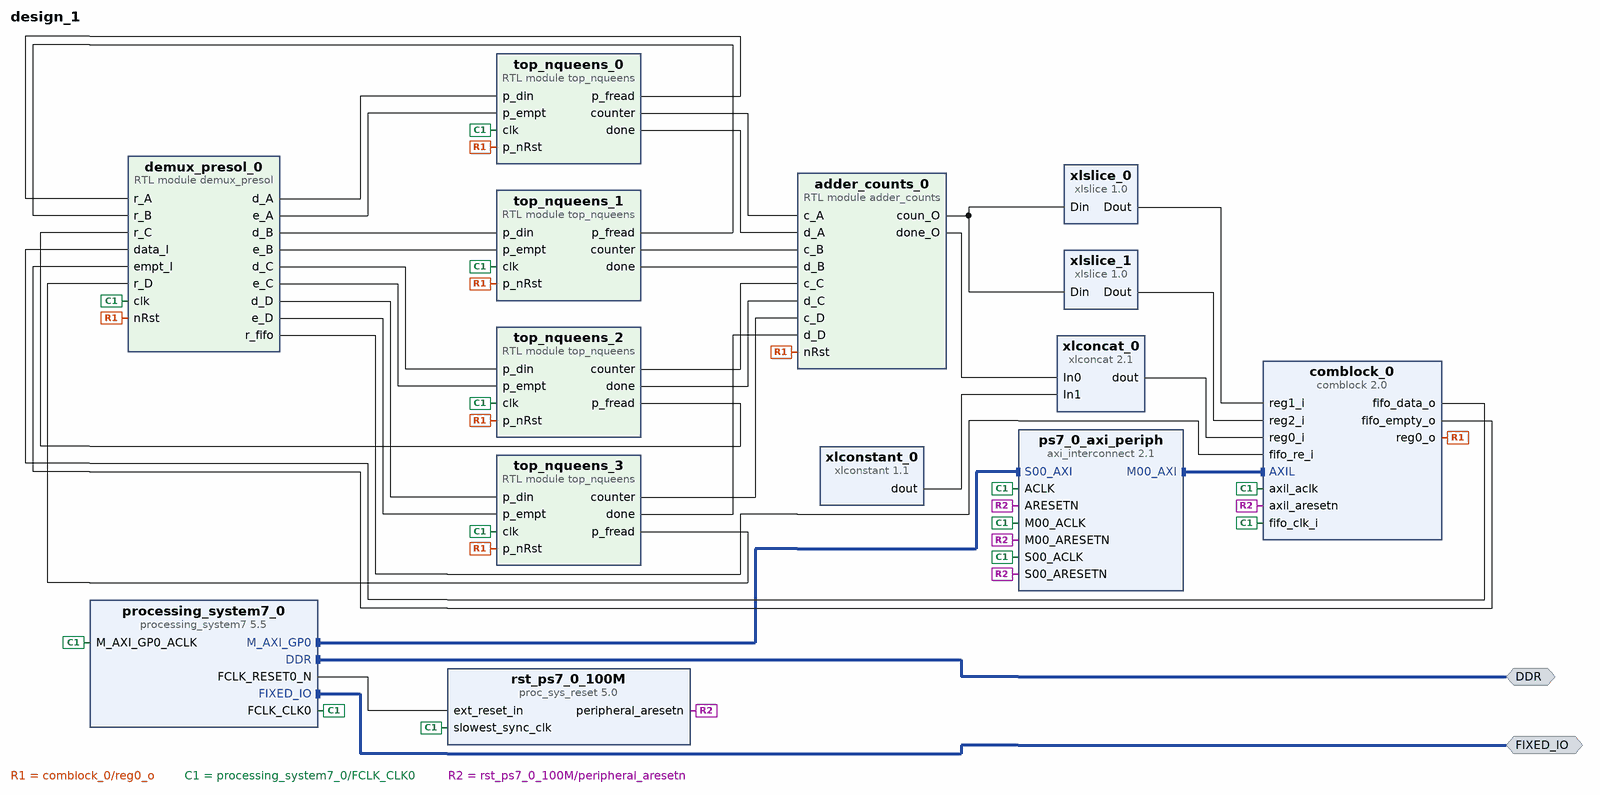
[diagram p0: block diagram of the top level]
# Vivado block design design_1, xc7z020clg484-1, Vivado 2021.2
create_bd_design design_1

create_bd_intf_port -mode Master -vlnv xilinx.com:interface:ddrx_rtl:1.0 DDR
create_bd_intf_port -mode Master -vlnv xilinx.com:display_processing_system7:fixedio_rtl:1.0 FIXED_IO

create_bd_cell -type ip -vlnv xilinx.com:ip:processing_system7:5.5 processing_system7_0
set_property -dict [list \
  CONFIG.PCW_APU_PERIPHERAL_FREQMHZ 666.666667 \
  CONFIG.PCW_ENET0_ENET0_IO {MIO 16 .. 27} \
  CONFIG.PCW_ENET0_GRP_MDIO_ENABLE 1 \
  CONFIG.PCW_ENET0_GRP_MDIO_IO {MIO 52 .. 53} \
  CONFIG.PCW_ENET0_PERIPHERAL_ENABLE 1 \
  CONFIG.PCW_ENET0_RESET_ENABLE 0 \
  CONFIG.PCW_ENET_RESET_ENABLE 1 \
  CONFIG.PCW_ENET_RESET_SELECT {Share reset pin} \
  CONFIG.PCW_FPGA0_PERIPHERAL_FREQMHZ 200 \
  CONFIG.PCW_FPGA1_PERIPHERAL_FREQMHZ 150.000000 \
  CONFIG.PCW_GPIO_MIO_GPIO_ENABLE 1 \
  CONFIG.PCW_GPIO_MIO_GPIO_IO MIO \
  CONFIG.PCW_I2C_RESET_ENABLE 1 \
  CONFIG.PCW_PRESET_BANK1_VOLTAGE {LVCMOS 1.8V} \
  CONFIG.PCW_QSPI_GRP_SINGLE_SS_ENABLE 1 \
  CONFIG.PCW_QSPI_GRP_SINGLE_SS_IO {MIO 1 .. 6} \
  CONFIG.PCW_QSPI_PERIPHERAL_ENABLE 1 \
  CONFIG.PCW_QSPI_QSPI_IO {MIO 1 .. 6} \
  CONFIG.PCW_SD0_GRP_CD_ENABLE 1 \
  CONFIG.PCW_SD0_GRP_CD_IO {MIO 47} \
  CONFIG.PCW_SD0_GRP_WP_ENABLE 1 \
  CONFIG.PCW_SD0_GRP_WP_IO {MIO 46} \
  CONFIG.PCW_SD0_PERIPHERAL_ENABLE 1 \
  CONFIG.PCW_SD0_SD0_IO {MIO 40 .. 45} \
  CONFIG.PCW_SDIO_PERIPHERAL_FREQMHZ 50 \
  CONFIG.PCW_SINGLE_QSPI_DATA_MODE x4 \
  CONFIG.PCW_TTC0_PERIPHERAL_ENABLE 1 \
  CONFIG.PCW_TTC0_TTC0_IO EMIO \
  CONFIG.PCW_UART1_PERIPHERAL_ENABLE 1 \
  CONFIG.PCW_UART1_UART1_IO {MIO 48 .. 49} \
  CONFIG.PCW_UART_PERIPHERAL_FREQMHZ 50 \
  CONFIG.PCW_UIPARAM_DDR_FREQ_MHZ 533.333313 \
  CONFIG.PCW_UIPARAM_DDR_PARTNO {MT41J128M16 HA-15E} \
  CONFIG.PCW_USB0_PERIPHERAL_ENABLE 1 \
  CONFIG.PCW_USB0_RESET_ENABLE 0 \
  CONFIG.PCW_USB0_USB0_IO {MIO 28 .. 39} \
  CONFIG.PCW_USB_RESET_ENABLE 1 \
  CONFIG.PCW_USB_RESET_SELECT {Share reset pin} \
  CONFIG.preset ZedBoard \
] [get_bd_cells processing_system7_0]
# 223 more settings of processing_system7_0 are not shown: defaults, MIO pin electricals, DDR timing, and values the tool derives
create_bd_cell -type ip -vlnv www.ictp.it:user:comblock:2.0 comblock_0
set_property -dict [list \
  CONFIG.DRAM_IO_ENA false \
  CONFIG.FIFO_IN_ENA false \
  CONFIG.FIFO_OUT_DWIDTH 32 \
  CONFIG.FIFO_OUT_ENA true \
  CONFIG.REGS_IN_DEPTH 3 \
  CONFIG.REGS_OUT_DEPTH 1 \
  CONFIG.REGS_OUT_DWIDTH 1 \
] [get_bd_cells comblock_0]
create_bd_cell -type ip -vlnv xilinx.com:ip:axi_interconnect:2.1 ps7_0_axi_periph
set_property -dict {CONFIG.NUM_MI 1} [get_bd_cells ps7_0_axi_periph]
create_bd_cell -type ip -vlnv xilinx.com:ip:proc_sys_reset:5.0 rst_ps7_0_100M
create_bd_cell -type ip -vlnv xilinx.com:ip:xlconstant:1.1 xlconstant_0
set_property -dict {CONFIG.CONST_VAL 0 CONFIG.CONST_WIDTH 31} [get_bd_cells xlconstant_0]
create_bd_cell -type ip -vlnv xilinx.com:ip:xlconcat:2.1 xlconcat_0
create_bd_cell -type module -reference demux_presol demux_presol_0
create_bd_cell -type ip -vlnv xilinx.com:ip:xlslice:1.0 xlslice_0
set_property -dict {CONFIG.DIN_FROM 31 CONFIG.DIN_WIDTH 64 CONFIG.DOUT_WIDTH 32} [get_bd_cells xlslice_0]
create_bd_cell -type ip -vlnv xilinx.com:ip:xlslice:1.0 xlslice_1
set_property -dict {CONFIG.DIN_FROM 63 CONFIG.DIN_TO 32 CONFIG.DIN_WIDTH 64 CONFIG.DOUT_WIDTH 32} [get_bd_cells xlslice_1]
create_bd_cell -type module -reference top_nqueens top_nqueens_0
set_property -dict {CONFIG.F 16 CONFIG.M 20 CONFIG.N 8 CONFIG.Q 2} [get_bd_cells top_nqueens_0]
create_bd_cell -type module -reference top_nqueens top_nqueens_1
set_property -dict {CONFIG.F 16 CONFIG.M 20 CONFIG.N 8 CONFIG.Q 2} [get_bd_cells top_nqueens_1]
create_bd_cell -type module -reference top_nqueens top_nqueens_2
set_property -dict {CONFIG.F 16 CONFIG.M 20 CONFIG.N 8 CONFIG.Q 2} [get_bd_cells top_nqueens_2]
create_bd_cell -type module -reference top_nqueens top_nqueens_3
set_property -dict {CONFIG.F 16 CONFIG.M 20 CONFIG.N 8 CONFIG.Q 2} [get_bd_cells top_nqueens_3]
create_bd_cell -type module -reference adder_counts adder_counts_0

# ---- connections ----

connect_bd_intf_net [get_bd_intf_ports DDR] [get_bd_intf_pins processing_system7_0/DDR]
connect_bd_intf_net [get_bd_intf_ports FIXED_IO] [get_bd_intf_pins processing_system7_0/FIXED_IO]
connect_bd_intf_net [get_bd_intf_pins processing_system7_0/M_AXI_GP0] [get_bd_intf_pins ps7_0_axi_periph/S00_AXI]
connect_bd_intf_net [get_bd_intf_pins ps7_0_axi_periph/M00_AXI] [get_bd_intf_pins comblock_0/AXIL]
connect_bd_net [get_bd_pins adder_counts_0/coun_O] [get_bd_pins xlslice_0/Din] [get_bd_pins xlslice_1/Din]
connect_bd_net [get_bd_pins adder_counts_0/done_O] [get_bd_pins xlconcat_0/In0]
connect_bd_net [get_bd_pins comblock_0/fifo_data_o] [get_bd_pins demux_presol_0/data_I]
connect_bd_net [get_bd_pins comblock_0/fifo_empty_o] [get_bd_pins demux_presol_0/empt_I]
connect_bd_net [get_bd_pins comblock_0/reg0_o] \
  [get_bd_pins demux_presol_0/nRst] [get_bd_pins top_nqueens_0/p_nRst] [get_bd_pins top_nqueens_1/p_nRst] \
  [get_bd_pins top_nqueens_2/p_nRst] [get_bd_pins top_nqueens_3/p_nRst] [get_bd_pins adder_counts_0/nRst]
connect_bd_net [get_bd_pins demux_presol_0/d_A] [get_bd_pins top_nqueens_0/p_din]
connect_bd_net [get_bd_pins demux_presol_0/d_B] [get_bd_pins top_nqueens_1/p_din]
connect_bd_net [get_bd_pins demux_presol_0/d_C] [get_bd_pins top_nqueens_2/p_din]
connect_bd_net [get_bd_pins demux_presol_0/d_D] [get_bd_pins top_nqueens_3/p_din]
connect_bd_net [get_bd_pins demux_presol_0/e_A] [get_bd_pins top_nqueens_0/p_empt]
connect_bd_net [get_bd_pins demux_presol_0/e_B] [get_bd_pins top_nqueens_1/p_empt]
connect_bd_net [get_bd_pins demux_presol_0/e_C] [get_bd_pins top_nqueens_2/p_empt]
connect_bd_net [get_bd_pins demux_presol_0/e_D] [get_bd_pins top_nqueens_3/p_empt]
connect_bd_net [get_bd_pins demux_presol_0/r_fifo] [get_bd_pins comblock_0/fifo_re_i]
connect_bd_net [get_bd_pins processing_system7_0/FCLK_CLK0] \
  [get_bd_pins processing_system7_0/M_AXI_GP0_ACLK] [get_bd_pins ps7_0_axi_periph/S00_ACLK] \
  [get_bd_pins rst_ps7_0_100M/slowest_sync_clk] [get_bd_pins comblock_0/axil_aclk] [get_bd_pins ps7_0_axi_periph/M00_ACLK] \
  [get_bd_pins ps7_0_axi_periph/ACLK] [get_bd_pins comblock_0/fifo_clk_i] [get_bd_pins demux_presol_0/clk] \
  [get_bd_pins top_nqueens_0/clk] [get_bd_pins top_nqueens_1/clk] [get_bd_pins top_nqueens_2/clk] \
  [get_bd_pins top_nqueens_3/clk]
connect_bd_net [get_bd_pins processing_system7_0/FCLK_RESET0_N] [get_bd_pins rst_ps7_0_100M/ext_reset_in]
connect_bd_net [get_bd_pins rst_ps7_0_100M/peripheral_aresetn] \
  [get_bd_pins ps7_0_axi_periph/S00_ARESETN] [get_bd_pins comblock_0/axil_aresetn] [get_bd_pins ps7_0_axi_periph/M00_ARESETN] \
  [get_bd_pins ps7_0_axi_periph/ARESETN]
connect_bd_net [get_bd_pins top_nqueens_0/counter] [get_bd_pins adder_counts_0/c_A]
connect_bd_net [get_bd_pins top_nqueens_0/done] [get_bd_pins adder_counts_0/d_A]
connect_bd_net [get_bd_pins top_nqueens_0/p_fread] [get_bd_pins demux_presol_0/r_A]
connect_bd_net [get_bd_pins top_nqueens_1/counter] [get_bd_pins adder_counts_0/c_B]
connect_bd_net [get_bd_pins top_nqueens_1/done] [get_bd_pins adder_counts_0/d_B]
connect_bd_net [get_bd_pins top_nqueens_1/p_fread] [get_bd_pins demux_presol_0/r_B]
connect_bd_net [get_bd_pins top_nqueens_2/counter] [get_bd_pins adder_counts_0/c_C]
connect_bd_net [get_bd_pins top_nqueens_2/done] [get_bd_pins adder_counts_0/d_C]
connect_bd_net [get_bd_pins top_nqueens_2/p_fread] [get_bd_pins demux_presol_0/r_C]
connect_bd_net [get_bd_pins top_nqueens_3/counter] [get_bd_pins adder_counts_0/c_D]
connect_bd_net [get_bd_pins top_nqueens_3/done] [get_bd_pins adder_counts_0/d_D]
connect_bd_net [get_bd_pins top_nqueens_3/p_fread] [get_bd_pins demux_presol_0/r_D]
connect_bd_net [get_bd_pins xlconcat_0/dout] [get_bd_pins comblock_0/reg0_i]
connect_bd_net [get_bd_pins xlconstant_0/dout] [get_bd_pins xlconcat_0/In1]
connect_bd_net [get_bd_pins xlslice_0/Dout] [get_bd_pins comblock_0/reg1_i]
connect_bd_net [get_bd_pins xlslice_1/Dout] [get_bd_pins comblock_0/reg2_i]

# ---- address map ----
assign_bd_address -offset 0x43C00000 -range 64K -target_address_space [get_bd_addr_spaces processing_system7_0/Data] [get_bd_addr_segs comblock_0/AXIL/AXIL]

validate_bd_design
save_bd_design
